# Altium project pcb_project.PrjPcb
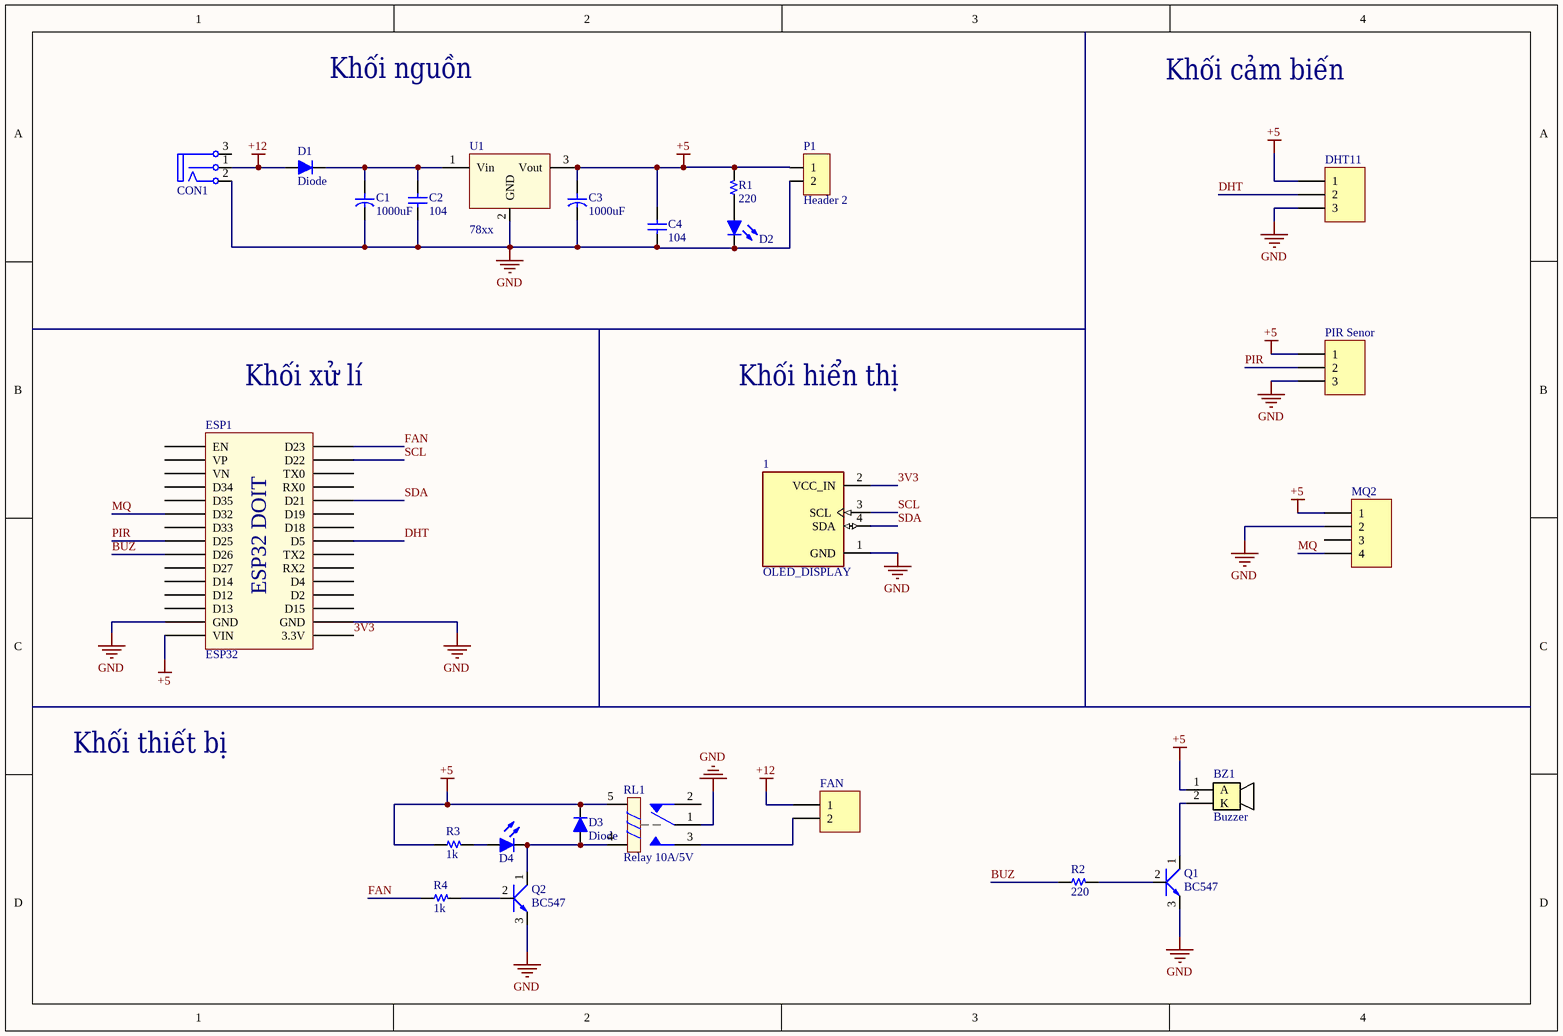
[diagram p0: doan1.SchDoc]
1 sheet, 25 parts. Net scope: global (net labels, ports and power ports of the same name join across sheets).
Board file: doan1_1.PcbDoc

## Sheet doan1.SchDoc
size A4; SheetNumber: 1; SheetTotal: 1

### Parts
1  OLED_DISPLAY  [MODULE_DM-OLED096-636]
BZ1  Buzzer  [BUZZER]
C1  1000uF  [CYL/D.400/LS.200]
C2  104  [CAP Ceramic/W300]
C3  1000uF  [CYL/D.400/LS.200]
C4  104  [CAP Ceramic/W300]
CON1  CON DC PWR  [CONN/DC/PWR/5.0MM]  (value not drawn)
D1  Diode  [DO-41]
D2  Led  [LED 3MM - red]  (value not drawn)
D3  Diode  [DO-41]
D4  Led  [LED 3MM - red]  (value not drawn)
DHT11  Header 3  [MY_FE03]  (value not drawn)
ESP1  ESP32  [ESP32 WROOM 32 KIT]
FAN  Header 2  [My_CN2]  (value not drawn)
MQ2  Header 4  [MY_FE04]  (value not drawn)
P1  Header 2  [HDR/Header/2]
PIR_Senor  Header 3  [MY_FE03W]  (value not drawn)
Q1  BC547  [QTO-92]
Q2  BC547  [QTO-92]
R1  220  [R 1/4W/300]
R2  220  [R 1/4W/300]
R3  1k  [R 1/4W/300]
R4  1k  [R 1/4W/300]
RL1  Relay 10A/5V  [RL_SPDT_10A]
U1  78xx  [TO-220]

### Nets
+5: BZ1.1(A) C3.1 C4.1 D3.2(K) DHT11.1 ESP1.15(VIN) MQ2.1 P1.1 PIR_Senor.1 R1.2 R3.1 RL1.5 U1.3(Vout)
+12: CON1.1(S) D1.1(A) FAN.1
GND: 1.1(GND) C1.2 C2.2 C3.2 C4.2 CON1.2(T) D2.2(K) DHT11.3 ESP1.14(GND) ESP1.17(GND) MQ2.2 P1.2 PIR_Senor.3 Q1.3(C) Q2.3(C) RL1.1 U1.2(GND)
3V3: 1.2(VCC_IN) ESP1.16(3.3V)
BUZ: ESP1.9(D26) R2.1
DHT: DHT11.2 ESP1.23(D5)
FAN: ESP1.30(D23) R4.1
MQ: ESP1.6(D32) MQ2.4
PIR: ESP1.8(D25) PIR_Senor.2
SCL: 1.3(SCL) ESP1.29(D22)
SDA: 1.4(SDA) ESP1.26(D21)
NetBZ1_2: BZ1.2(K) Q1.1(B)
NetC1_1: C1.1 C2.1 D1.2(K) U1.1(Vin)
NetD2_1: D2.1(A) R1.1
NetD3_1: D3.1(A) D4.2(K) Q2.1(B) RL1.4
NetD4_1: D4.1(A) R3.2
NetFAN_2: FAN.2 RL1.3
NetQ1_2: Q1.2(E) R2.2
NetQ2_2: Q2.2(E) R4.2

Not connected (* = marked no-connect by the designer): CON1 3(TN); ESP1 1(EN) 2(VP) 3(VN) 4(D34) 5(D35) 7(D33) 10(D27) 11(D14) 12(D12) 13(D13) 18(D15) 19(D2) 20(D4) 21(RX2) 22(TX2) 24(D18) 25(D19) 27(RX0) 28(TX0); MQ2 3; RL1 2

### Notes on the sheet
- Khối nguồn
- Khối cảm biến
- (near ESP1) Khối xử lí
- Khối hiển thị
- Khối thiết bị
- (in symbol ESP32 WROOM 32 KIT) ESP32 DOIT

### Library data of the parts
1 = DM-OLED096-636: 0.96â€ 128 X 64 MONOCHROME GRAPHIC OLED DISPLAY MODULE - I2C; SnapEDA_Link: https://www.snapeda.com/parts/DM-OLED096-636/Display+Module/view-part/?ref=snap; Package: Package; Value: *; MF: Display Module; MP: DM-OLED096-636; Check_prices: https://www.snapeda.com/parts/DM-OLED096-636/Display+Module/view-part/?ref=eda
C1 C3 = Capacitor: Capacitor pol
C2 C4 = Capacitor NP: Capacitor non-pol
CON1 = CON DC PWR: DC input connector
D1 D3 = Diode: Default Diode
D2 D4 = Led: Typical LED
DHT11 PIR_Senor = Header 3: Header, 3-Pin; ASiD Part Number: Header 3-AS
ESP1 = ESP32 WROOM 32 KIT
FAN = Header 2: Header, 2-Pin; ASiD Part Number: Header 2-AS
MQ2 = Header 4: Header, 4-Pin; ASiD Part Number: Header 4-AS
P1 = Header 2: Header, 2-Pin
Q1 Q2 = C1815: NPN 600mW, ECB; Value: C1815
R1-R4 = Resistor
RL1 = Relay 1: Relay SPDT,10A - 12VDC 5 Pin; Value: Relay SPDT, 10A, 12V
U1 = 78xx: LDO Fixed Voltage regulator